# Altium schematic sheet P09 SYS of Hi3519.SchDoc
size 420 x 297 mm
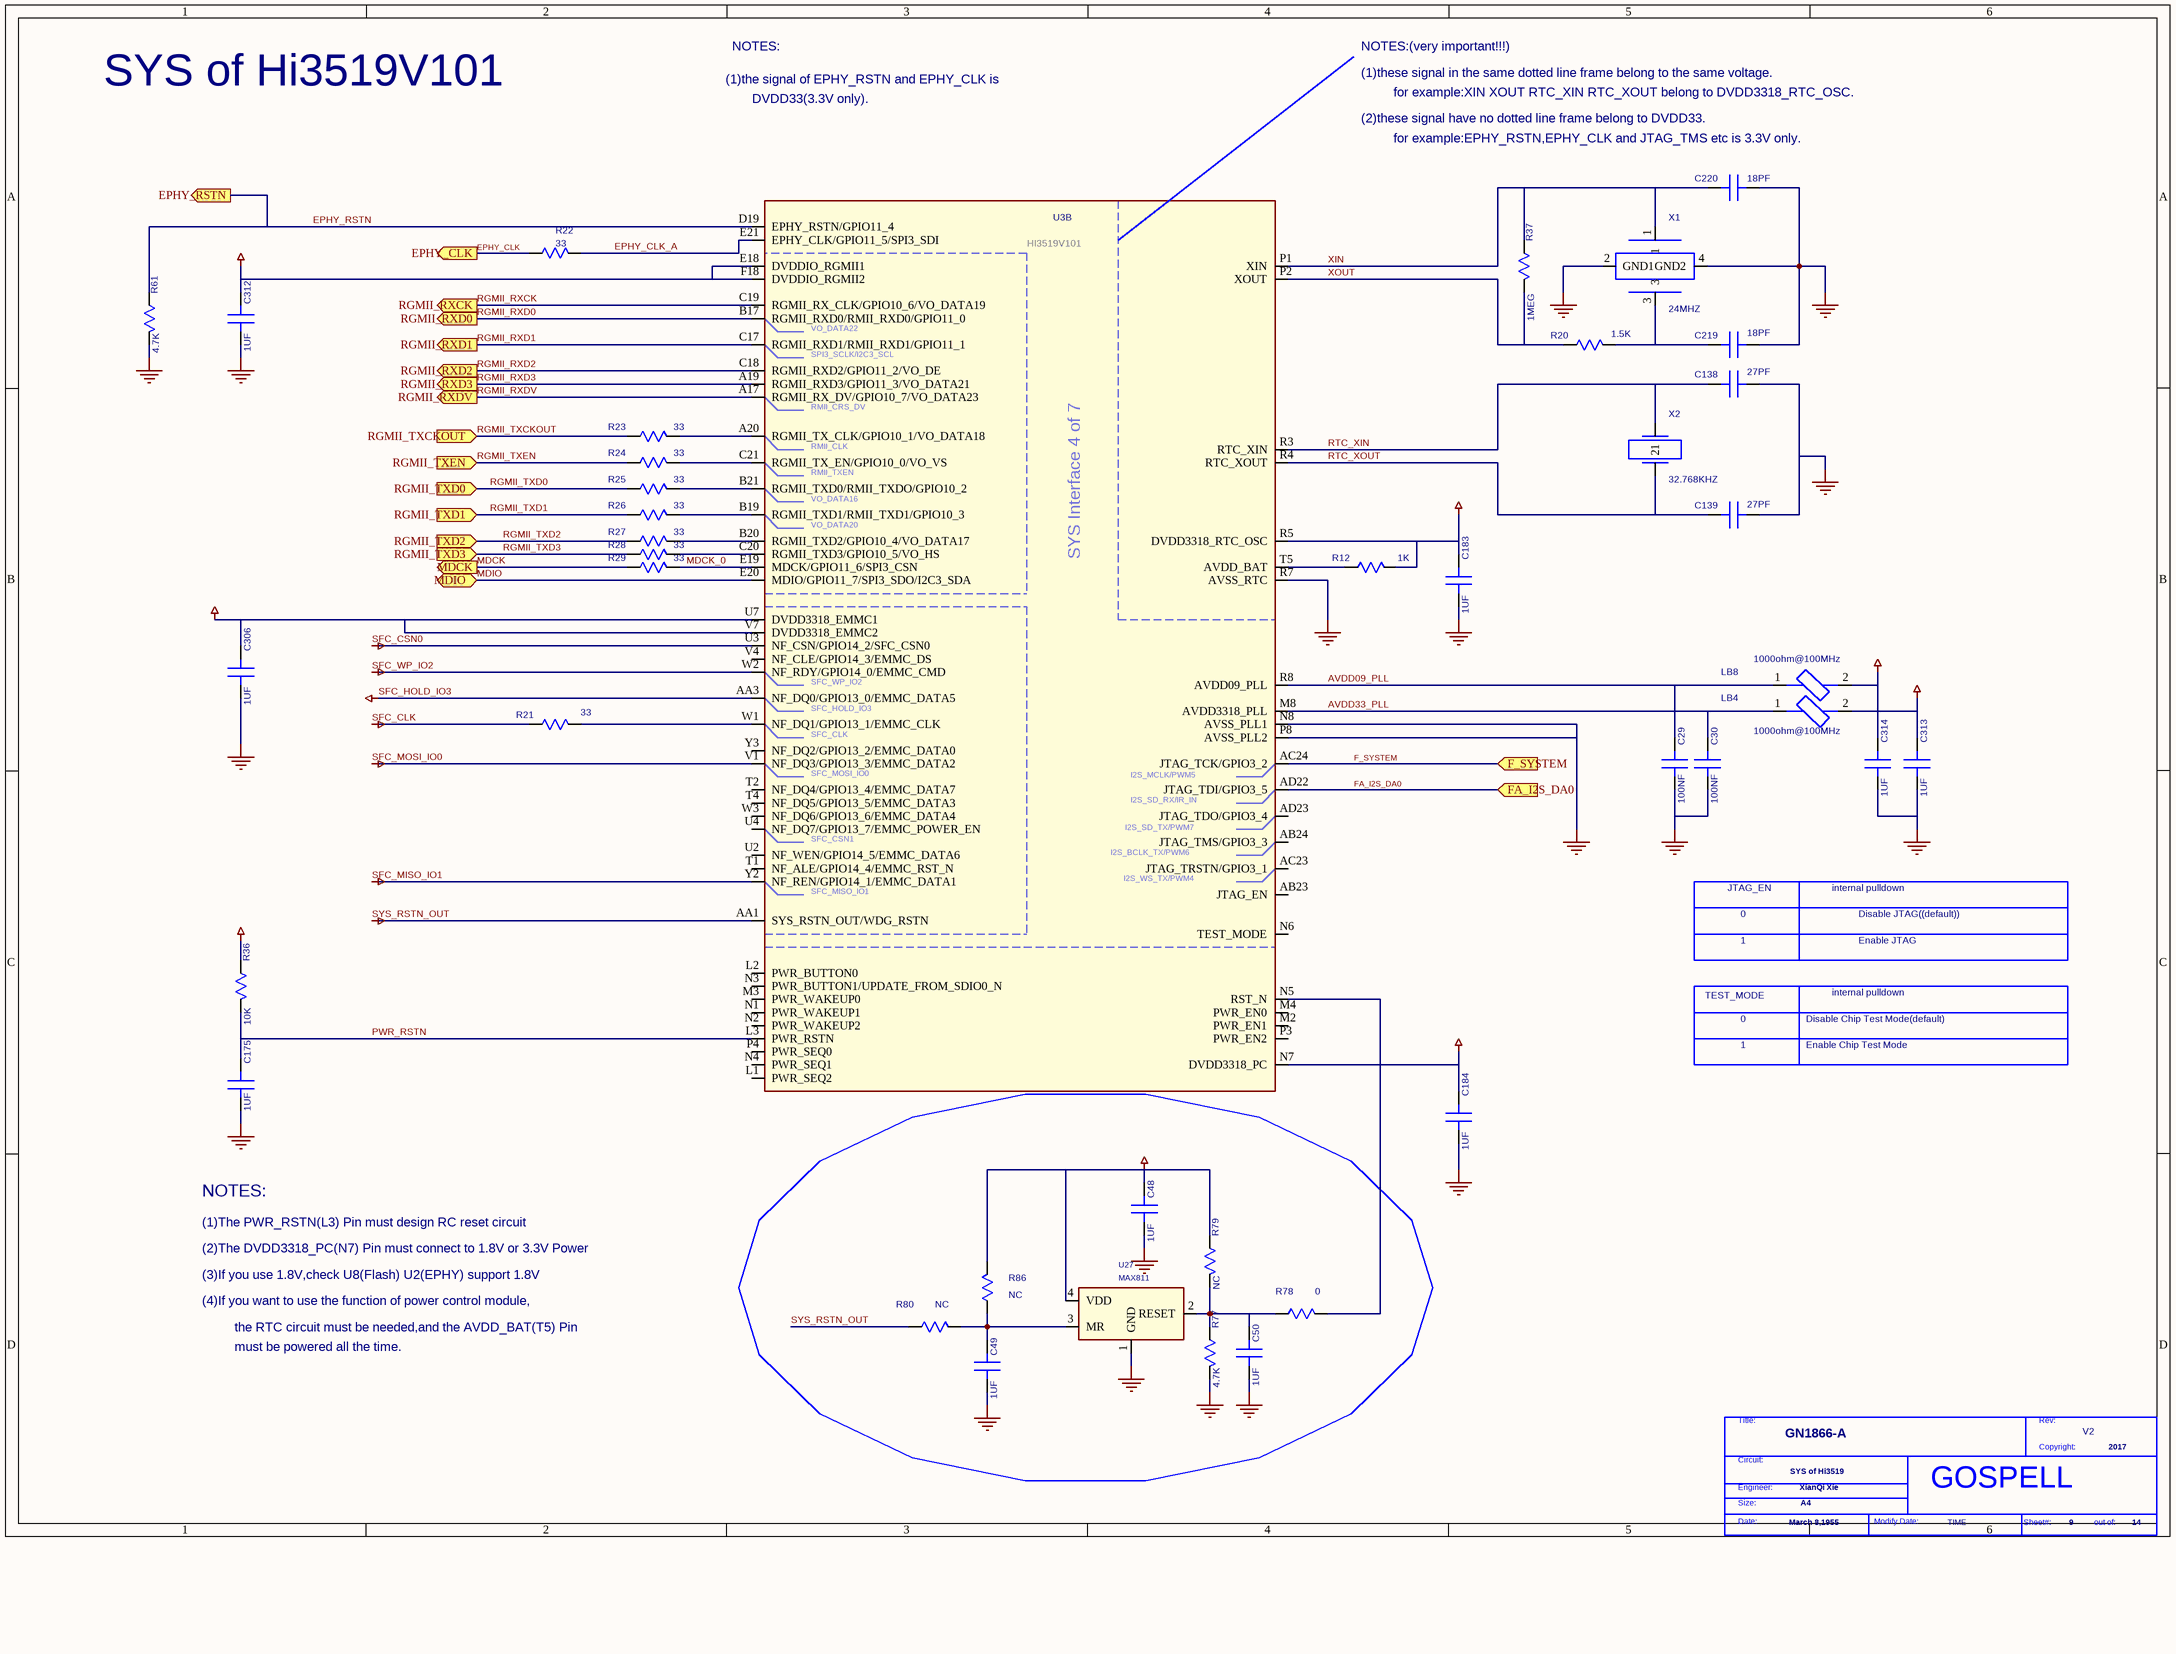
[diagram p0: P09 SYS of Hi3519.SchDoc]

## Parts
*  Page Modify Date: TIME  Engineer: XianQi Xie  Copyright: 2017  Title: GN1866-A  RevCode: V2  Page Size: A4  Page Create Date: March 8,1955  Page Number: 9  Page Count: 14  Doc: SYS of Hi3519  (hidden comment: GOSPELL)  (graphical)
C29  100NF  [HSC0201]
C30  100NF  [HSC0201]
C48  1UF  [SC0402]
C49  1UF  [SC0402]
C50  1UF  [SC0402]
C138  27PF  [SC0402]
C139  27PF  [SC0402]
C175  1UF  [HSC0201]
C183  1UF  [HSC0201]
C184  1UF  [HSC0201]
C219  18PF  [SC0402]
C220  18PF  [SC0402]
C306  1UF  [HSC0201]
C312  1UF  [HSC0201]
C313  1UF  [HSC0201]
C314  1UF  [HSC0201]
LB4  LB  [HSL0201-TB]  (value not drawn)
LB8  LB  [HSL0201-TB]  (value not drawn)
R12  1K  [SR0402]
R20  1.5K  [SR0402]
R21  33  [SR0402]
R22  33  [SR0402]
R23  33  [SR0402]
R24  33  [SR0402]
R25  33  [SR0402]
R26  33  [SR0402]
R27  33  [SR0402]
R28  33  [SR0402]
R29  33  [SR0402]
R36  10K  [SR0402]
R37  1MEG  [SR0402]
R61  4.7K  [SR0402]
R77  4.7K  [SR0402]
R78  0  [SR0402]
R79  NC  [SR0402]
R80  NC  [SR0402]
R86  NC  [SR0402]
U3  DEVICE: HI3519V101  [HBGA524-16-2424]  (hidden comment: HI3519V101_PER)  (part B of 7)
U27  MAX811  [SOT23-4]
X1  24MHZ  [HSX4-0302]
X2  32.768KHZ  [HSX2-0302]

## Ports
EPHY_CLK (out), EPHY_RSTN (out), F_SYSTEM (in), FA_I2S_DA0 (in), MDCK (out), MDIO (bidir), RGMII_RXCK (out), RGMII_RXD0 (out), RGMII_RXD1 (out), RGMII_RXD2 (out), RGMII_RXD3 (out), RGMII_RXDV (out), RGMII_TXCKOUT (in), RGMII_TXD0 (in), RGMII_TXD1 (in), RGMII_TXD2 (in), RGMII_TXD3 (in), RGMII_TXEN (in)

## Nets
3V3/1V8: C48.1(A) C183.1(A) C184.1(A) C306.1(A) C312.1(A) C313.1(A) LB4.2 R12.2(B) R36.1(A) R79.1(A) R86.2(B) U3.E18(DVDDIO_RGMII1) U3.F18(DVDDIO_RGMII2) U3.N7(DVDD3318_PC) U3.R5(DVDD3318_RTC_OSC) U3.U7(DVDD3318_EMMC1) U3.V7(DVDD3318_EMMC2) U27.4(VDD)
GND: C29.2(B) C30.2(B) C48.2(B) C49.2(B) C50.2(B) C138.2(B) C139.2(B) C175.2(B) C183.2(B) C184.2(B) C219.2(B) C220.2(B) C306.2(B) C312.2(B) C313.2(B) C314.2(B) R61.2(B) R77.2(B) U3.N8(AVSS_PLL1) U3.P8(AVSS_PLL2) U3.R7(AVSS_RTC) U27.1(GND) X1.2(GND1) X1.4(GND2)
SFC_CLK: R21.1(A)
SFC_CSN0: U3.U3(NF_CSN/GPIO14_2/SFC_CSN0)
SFC_HOLD_IO3: U3.AA3(NF_DQ0/GPIO13_0/EMMC_DATA5)
SFC_MISO_IO1: U3.Y2(NF_REN/GPIO14_1/EMMC_DATA1)
SFC_MOSI_IO0: U3.V1(NF_DQ3/GPIO13_3/EMMC_DATA2)
SFC_WP_IO2: U3.W2(NF_RDY/GPIO14_0/EMMC_CMD)
SYS_RSTN_OUT: R80.1(A) U3.AA1(SYS_RSTN_OUT/WDG_RSTN)
VCC_VDD_DDR_CORE: C314.1(A) LB8.2
AVDD09_PLL: C29.1(A) LB8.1 U3.R8(AVDD09_PLL)
AVDD33_PLL: C30.1(A) LB4.1 U3.M8(AVDD3318_PLL)
EPHY_CLK: R22.1(A) ; port EPHY_CLK
EPHY_CLK_A: R22.2(B) U3.E21(EPHY_CLK/GPIO11_5/SPI3_SDI)
EPHY_RSTN: R61.1(A) U3.D19(EPHY_RSTN/GPIO11_4) ; port EPHY_RSTN
F_SYSTEM: U3.AC24(JTAG_TCK/GPIO3_2) ; port F_SYSTEM
FA_I2S_DA0: U3.AD22(JTAG_TDI/GPIO3_5) ; port FA_I2S_DA0
MDCK: R29.1(A) ; port MDCK
MDCK_0: R29.2(B) U3.E19(MDCK/GPIO11_6/SPI3_CSN)
MDIO: U3.E20(MDIO/GPIO11_7/SPI3_SDO/I2C3_SDA) ; port MDIO
PWR_RSTN: C175.1(A) R36.2(B) U3.L3(PWR_RSTN)
RGMII_RXCK: U3.C19(RGMII_RX_CLK/GPIO10_6/VO_DATA19) ; port RGMII_RXCK
RGMII_RXD0: U3.B17(RGMII_RXD0/RMII_RXD0/GPIO11_0) ; port RGMII_RXD0
RGMII_RXD1: U3.C17(RGMII_RXD1/RMII_RXD1/GPIO11_1) ; port RGMII_RXD1
RGMII_RXD2: U3.C18(RGMII_RXD2/GPIO11_2/VO_DE) ; port RGMII_RXD2
RGMII_RXD3: U3.A19(RGMII_RXD3/GPIO11_3/VO_DATA21) ; port RGMII_RXD3
RGMII_RXDV: U3.A17(RGMII_RX_DV/GPIO10_7/VO_DATA23) ; port RGMII_RXDV
RGMII_TXCKOUT: R23.1(A) ; port RGMII_TXCKOUT
RGMII_TXD0: R25.1(A) ; port RGMII_TXD0
RGMII_TXD1: R26.1(A) ; port RGMII_TXD1
RGMII_TXD2: R27.1(A) ; port RGMII_TXD2
RGMII_TXD3: R28.1(A) ; port RGMII_TXD3
RGMII_TXEN: R24.1(A) ; port RGMII_TXEN
RTC_XIN: C138.1(A) U3.R3(RTC_XIN) X2.1
RTC_XOUT: C139.1(A) U3.R4(RTC_XOUT) X2.2
XIN: C220.1(A) R37.1(A) U3.P1(XIN) X1.1
XOUT: R20.1(A) R37.2(B) U3.P2(XOUT)
NetC49_1: C49.1(A) R80.2(B) R86.1(A) U27.3(MR)
NetC50_1: C50.1(A) R77.1(A) R78.1(A) R79.2(B) U27.2(RESET)
NetC219_1: C219.1(A) R20.2(B) X1.3
NetR12_1: R12.1(A) U3.T5(AVDD_BAT)
NetR21_2: R21.2(B) U3.W1(NF_DQ1/GPIO13_1/EMMC_CLK)
NetR23_2: R23.2(B) U3.A20(RGMII_TX_CLK/GPIO10_1/VO_DATA18)
NetR24_2: R24.2(B) U3.C21(RGMII_TX_EN/GPIO10_0/VO_VS)
NetR25_2: R25.2(B) U3.B21(RGMII_TXD0/RMII_TXDO/GPIO10_2)
NetR26_2: R26.2(B) U3.B19(RGMII_TXD1/RMII_TXD1/GPIO10_3)
NetR27_2: R27.2(B) U3.B20(RGMII_TXD2/GPIO10_4/VO_DATA17)
NetR28_2: R28.2(B) U3.C20(RGMII_TXD3/GPIO10_5/VO_HS)
NetR78_2: R78.2(B) U3.N5(RST_N)

Not connected (* = marked no-connect by the designer): U3 AB23(JTAG_EN) AB24(JTAG_TMS/GPIO3_3) AC23(JTAG_TRSTN/GPIO3_1) AD23(JTAG_TDO/GPIO3_4) L1(PWR_SEQ2) L2(PWR_BUTTON0) M2(PWR_EN1) M3(PWR_WAKEUP0) M4(PWR_EN0) N1(PWR_WAKEUP1) N2(PWR_WAKEUP2) N3(PWR_BUTTON1/UPDATE_FROM_SDIO0_N) N4(PWR_SEQ1) N6(TEST_MODE) P3(PWR_EN2) P4(PWR_SEQ0) T1(NF_ALE/GPIO14_4/EMMC_RST_N) T2(NF_DQ4/GPIO13_4/EMMC_DATA7) T4(NF_DQ5/GPIO13_5/EMMC_DATA3) U2(NF_WEN/GPIO14_5/EMMC_DATA6) U4(NF_DQ7/GPIO13_7/EMMC_POWER_EN) V4(NF_CLE/GPIO14_3/EMMC_DS) W3(NF_DQ6/GPIO13_6/EMMC_DATA4) Y3(NF_DQ2/GPIO13_2/EMMC_DATA0)

## Notes on the sheet
- NOTES:
- NOTES:(very important!!!)
- SYS of Hi3519V101
- (1)the signal of EPHY_RSTN and EPHY_CLK is
- DVDD33(3.3V only).
- (2)these signal have no dotted line frame belong to DVDD33.
- (1)these signal in the same dotted line frame belong to the same voltage.
- for example:XIN XOUT RTC_XIN RTC_XOUT belong to DVDD3318_RTC_OSC.
- (near C220) for example:EPHY_RSTN,EPHY_CLK and JTAG_TMS etc is 3.3V only.
- (near LB8) 1000ohm@100MHz
- (near LB4) 1000ohm@100MHz
- JTAG_EN
- internal pulldown
- 1
- 0
- Disable JTAG((default))
- Enable JTAG
- TEST_MODE
- Disable Chip Test Mode(default)
- Enable Chip Test Mode
- (1)The PWR_RSTN(L3) Pin must design RC reset circuit
- (3)If you use 1.8V,check U8(Flash) U2(EPHY) support 1.8V
- (2)The DVDD3318_PC(N7) Pin must connect to 1.8V or 3.3V Power
- (4)If you want to use the function of power control module,
- the RTC circuit must be needed,and the AVDD_BAT(T5) Pin
- must be powered all the time.
- (in symbol GOSPELL) Title:; Rev:; Copyright:; Circuit:; Engineer:; Size:; Date:; Modify Date:; Sheet#:; out of:
- (in symbol HI3519V101_PER_2, part B) VO_DATA22; SPI3_SCLK/I2C3_SCL; RMII_CRS_DV; RMII_CLK; RMII_TXEN; VO_DATA16; VO_DATA20; SYS Interface 4 of 7; SFC_WP_IO2; SFC_HOLD_IO3; SFC_CLK; SFC_MOSI_IO0; I2S_MCLK/PWM5; I2S_SD_RX/IR_IN; I2S_SD_TX/PWM7; SFC_CSN1; I2S_BCLK_TX/PWM6; I2S_WS_TX/PWM4; SFC_MISO_IO1

## Library data of the parts
C29 C30 = C_0_Dup2: PARTS: 1; OriginalSymbolOrigin: (0,30); DEVICE: GRM033R60J104KE19D; LEVEL: STD; PINSWAP: (A,B); CODE: 8070704; %195%%232%%202%%246%: SMD陶瓷电容-6.3V-100NF-+/-10%-X5R-0201-TS16949; %182%%238%%182%%168%%185%%164%%215%%247%%181%%231%%209%%185%(V): 6.3; COMPONENT_HIGH_MAX: 0.33MM; %208%%161%%192%%224%%195%%251%%179%%198%: SMD陶瓷电容; GVALUE: C  6.3V  0.1uF +80%~-20%  X5R 0201; PKG_TYPE: HSC0201
C48-C50 = C_0_Dup2: PARTS: 1; OriginalSymbolOrigin: (0,30); DEVICE: CV05X5R105K10AH; LEVEL: STD; PINSWAP: (A,B); GVALUE: C  10V  1uF +80%~-20%  X5R 0402; CODE: 8070612; %195%%232%%202%%246%: SMD陶瓷电容-10V-1000NF-+/-10%-X5R-0402-BT,TS16949; %182%%238%%182%%168%%185%%164%%215%%247%%181%%231%%209%%185%(V): 10; COMPONENT_HIGH_MAX: 0.55MM; %208%%161%%192%%224%%195%%251%%179%%198%: SMD陶瓷电容; PKG_TYPE: SC0402
C138 = C_0_Dup2: PARTS: 1; OriginalSymbolOrigin: (0,30); DEVICE: C0402C270J5GAC_7867; LEVEL: STD; PINSWAP: (A,B); %208%%161%%192%%224%%195%%251%%179%%198%: SMD陶瓷电容; COMPONENT_HIGH_MAX: 0.55MM; %182%%238%%182%%168%%185%%164%%215%%247%%181%%231%%209%%185%(V): 50; %195%%232%%202%%246%: SMD陶瓷电容-50V-0.027NF-+/-5%-NP0-0402-BT; CODE: 8070546; GVALUE: C  50V  27pF +80%~-20% NP0 0402; PKG_TYPE: SC0402
C139 = C_0_Dup2: PARTS: 1; OriginalSymbolOrigin: (0,30); DEVICE: C0402C270J5GAC_7867; LEVEL: STD; PINSWAP: (A,B); CODE: 8070546; %195%%232%%202%%246%: SMD陶瓷电容-50V-0.027NF-+/-5%-NP0-0402-BT; %182%%238%%182%%168%%185%%164%%215%%247%%181%%231%%209%%185%(V): 50; COMPONENT_HIGH_MAX: 0.55MM; %208%%161%%192%%224%%195%%251%%179%%198%: SMD陶瓷电容; GVALUE: C  50V  27pF +80%~-20% NP0 0402; PKG_TYPE: SC0402
C175 = C_0_Dup2: PARTS: 1; OriginalSymbolOrigin: (0,30); DEVICE: CM03X5R105M06AH_A; LEVEL: STD; PINSWAP: (A,B); %208%%161%%192%%224%%195%%251%%179%%198%: SMD陶瓷电容; COMPONENT_HIGH_MAX: 0.35MM; %195%%232%%202%%246%: SMD陶瓷电容-4V-1000NF-+/-20%-X5R-0201(0.65MM*0.35MM*0.35MM)-终端专用; CODE: 8071128; GVALUE: C  4V  1uF +80%~-20%  X5R 0201(0.65MM*0.35MM*0.35MM); PKG_TYPE: HSC0201
C183 C312 C314 = C_0_Dup2: PARTS: 1; OriginalSymbolOrigin: (0,30); DEVICE: CM03X5R105M06AH_A; LEVEL: STD; PINSWAP: (A,B); %208%%161%%192%%224%%195%%251%%179%%198%: SMD陶瓷电容; COMPONENT_HIGH_MAX: 0.35MM; %182%%238%%182%%168%%185%%164%%215%%247%%181%%231%%209%%185%(V): 6.3; %195%%232%%202%%246%: SMD陶瓷电容-4V-1000NF-+/-20%-X5R-0201(0.65MM*0.35MM*0.35MM)-终端专用; CODE: 8071128; GVALUE: C  4V  1uF +80%~-20%  X5R 0201(0.65MM*0.35MM*0.35MM); PKG_TYPE: HSC0201
C184 C313 = C_0_Dup2: PARTS: 1; OriginalSymbolOrigin: (0,30); DEVICE: CM03X5R105M06AH_A; LEVEL: STD; PINSWAP: (A,B); CODE: 8071128; %195%%232%%202%%246%: SMD陶瓷电容-4V-1000NF-+/-20%-X5R-0201(0.65MM*0.35MM*0.35MM)-终端专用; %182%%238%%182%%168%%185%%164%%215%%247%%181%%231%%209%%185%(V): 6.3; COMPONENT_HIGH_MAX: 0.35MM; %208%%161%%192%%224%%195%%251%%179%%198%: SMD陶瓷电容; GVALUE: C  4V  1uF +80%~-20%  X5R 0201(0.65MM*0.35MM*0.35MM); PKG_TYPE: HSC0201
C219 = C_0_Dup2: PARTS: 1; OriginalSymbolOrigin: (0,30); DEVICE: C0402C180J5GAC_7867; LEVEL: STD; PINSWAP: (A,B); CODE: 8070580; %195%%232%%202%%246%: SMD陶瓷电容-50V-0.018NF-+/-5%-NPO-0402; %182%%238%%182%%168%%185%%164%%215%%247%%181%%231%%209%%185%(V): 50; COMPONENT_HIGH_MAX: 0.55MM; %208%%161%%192%%224%%195%%251%%179%%198%: SMD陶瓷电容; GVALUE: C  50V  18pF +80%~-20% NPO-0402; PKG_TYPE: SC0402
C220 = C_0_Dup2: PARTS: 1; OriginalSymbolOrigin: (0,30); DEVICE: C0402C180J5GAC_7867; LEVEL: STD; PINSWAP: (A,B); GVALUE: C  50V  18pF +80%~-20% NPO-0402; CODE: 8070580; %195%%232%%202%%246%: SMD陶瓷电容-50V-0.018NF-+/-5%-NPO-0402; %182%%238%%182%%168%%185%%164%%215%%247%%181%%231%%209%%185%(V): 50; COMPONENT_HIGH_MAX: 0.55MM; %208%%161%%192%%224%%195%%251%%179%%198%: SMD陶瓷电容; PKG_TYPE: SC0402
C306 = C_0_Dup2: PARTS: 1; OriginalSymbolOrigin: (0,30); DEVICE: CM03X5R105M06AH_A; LEVEL: STD; PINSWAP: (A,B); %208%%161%%192%%224%%195%%251%%179%%198%: SMD陶瓷电容; COMPONENT_HIGH_MAX: 0.35MM; %182%%238%%182%%168%%185%%164%%215%%247%%181%%231%%209%%185%(V): 10; %195%%232%%202%%246%: SMD陶瓷电容-4V-1000NF-+/-20%-X5R-0201(0.65MM*0.35MM*0.35MM)-终端专用; CODE: 8071128; GVALUE: C  4V  1uF +80%~-20%  X5R 0201(0.65MM*0.35MM*0.35MM); PKG_TYPE: HSC0201
LB4 = LB_0: PARTS: 1; OriginalSymbolOrigin: (20,50); LEVEL: STD; DEVICE: NOOO; CODE: 99053XWH; %195%%232%%202%%246%: EMI磁珠-+/-25%-1000OHM-1.25OHM-0.25A-0402-1400OHM@1GHZ; COMPONENT_HIGH_MAX: 0.65MM; %208%%161%%192%%224%%195%%251%%179%%198%: EMI磁珠; GVALUE: 麦捷:0201磁珠80欧; PKG_TYPE: HSL0201-TB
LB8 = LB_0: PARTS: 1; OriginalSymbolOrigin: (20,50); LEVEL: STD; DEVICE: NOOO; CODE: 99053XWH; %208%%161%%192%%224%%195%%251%%179%%198%: EMI磁珠; COMPONENT_HIGH_MAX: 0.65MM; %195%%232%%202%%246%: EMI磁珠-+/-25%-1000OHM-1.25OHM-0.25A-0402-1400OHM@1GHZ; GVALUE: 麦捷:0201磁珠80欧; PKG_TYPE: HSL0201-TB
R12 = R_0: PARTS: 1; OriginalSymbolOrigin: (10,20); PINSWAP: (A,B); DEVICE: RC0603JR_07510R; PKG_TYPE: SR0603; LEVEL: STD; CODE: 7090638; %195%%232%%202%%246%: 片式厚膜电阻器-0.1W-510OHM-+/-5%-0603; %182%%238%%182%%168%%185%%166%%194%%202%(W): 0.1; %215%%232%%214%%181%%212%%202%%208%%237%%198%%171%%178%%238%: +/-5%; COMPONENT_HIGH_MAX: 0.55MM; %208%%161%%192%%224%%195%%251%%179%%198%: 片式厚膜电阻器; GVALUE: R 1/16W 1K±5% 0402
R20 = R_0: PARTS: 1; OriginalSymbolOrigin: (10,20); PINSWAP: (A,B); DEVICE: RC_02W100FT; LEVEL: STD; CODE: 7091305; %195%%232%%202%%246%: 片式厚膜电阻器-0.0625W-10OHM-+/-1%-0402; %182%%238%%182%%168%%185%%166%%194%%202%(W): 0.06; %215%%232%%214%%181%%212%%202%%208%%237%%198%%171%%178%%238%: +/-1%; COMPONENT_HIGH_MAX: 0.4MM; %208%%161%%192%%224%%195%%251%%179%%198%: 片式厚膜电阻器; GVALUE: R 1/16W 1.5K±5% 0402; PKG_TYPE: SR0402
R21 R23-R29 = R_0: PARTS: 1; OriginalSymbolOrigin: (10,20); PINSWAP: (A,B); DEVICE: RC0402FR_0733RL; LEVEL: STD; CODE: 7090836; %195%%232%%202%%246%: 片式厚膜电阻器-0.0625W-33OHM-+/-1%-0402; %182%%238%%182%%168%%185%%166%%194%%202%(W): 0.06; %215%%232%%214%%181%%212%%202%%208%%237%%198%%171%%178%%238%: +/-1%; COMPONENT_HIGH_MAX: 0.4MM; %208%%161%%192%%224%%195%%251%%179%%198%: 片式厚膜电阻器; GVALUE: R 1/16W 33±5% 0402; PKG_TYPE: SR0402
R22 = R_0: PARTS: 1; OriginalSymbolOrigin: (10,20); PINSWAP: (A,B); DEVICE: RC0402FR_0733RL; LEVEL: STD; %208%%161%%192%%224%%195%%251%%179%%198%: 片式厚膜电阻器; COMPONENT_HIGH_MAX: 0.4MM; %215%%232%%214%%181%%212%%202%%208%%237%%198%%171%%178%%238%: +/-1%; %182%%238%%182%%168%%185%%166%%194%%202%(W): 0.06; %195%%232%%202%%246%: 片式厚膜电阻器-0.0625W-33OHM-+/-1%-0402; CODE: 7090836; GVALUE: R 1/16W 33±5% 0402; PKG_TYPE: SR0402
R36 = R_0: PARTS: 1; OriginalSymbolOrigin: (10,20); PINSWAP: (A,B); DEVICE: RC_02W103JT; LEVEL: STD; CODE: 7090815; %195%%232%%202%%246%: 片式厚膜电阻器-0.0625W-10000OHM-+/-5%-0402-BT; %182%%238%%182%%168%%185%%166%%194%%202%(W): 0.06; %215%%232%%214%%181%%212%%202%%208%%237%%198%%171%%178%%238%: +/-5%; COMPONENT_HIGH_MAX: 0.4MM; %208%%161%%192%%224%%195%%251%%179%%198%: 片式厚膜电阻器; GVALUE: R 1/16W 10K±5% 0402; PKG_TYPE: SR0402
R37 = R_0: PARTS: 1; OriginalSymbolOrigin: (10,20); PINSWAP: (A,B); DEVICE: RK73H1ETTP1004F; LEVEL: STD; GVALUE: R 1/16W 1M±5% 0402; CODE: 7090857; %195%%232%%202%%246%: 片式厚膜电阻器-0.0625W-1000000OHM-+/-1%-0402; %182%%238%%182%%168%%185%%166%%194%%202%(W): 0.06; %215%%232%%214%%181%%212%%202%%208%%237%%198%%171%%178%%238%: +/-1%; COMPONENT_HIGH_MAX: 0.4MM; %208%%161%%192%%224%%195%%251%%179%%198%: 片式厚膜电阻器; PKG_TYPE: SR0402
R61 = R_0: PARTS: 1; OriginalSymbolOrigin: (10,20); PINSWAP: (A,B); DEVICE: RK73B1ELTP472J; LEVEL: STD; CODE: 7090793; %195%%232%%202%%246%: 片式厚膜电阻器-0.0625W-4700OHM-+/-5%-0402-BT; %182%%238%%182%%168%%185%%166%%194%%202%(W): 0.06; %215%%232%%214%%181%%212%%202%%208%%237%%198%%171%%178%%238%: +/-5%; COMPONENT_HIGH_MAX: 0.4MM; %208%%161%%192%%224%%195%%251%%179%%198%: 片式厚膜电阻器; GVALUE: R 1/16W 4.7K±5% 0402; PKG_TYPE: SR0402
R77 = R_0: PARTS: 1; OriginalSymbolOrigin: (10,20); PINSWAP: (A,B); DEVICE: RK73B1ELTP472J; LEVEL: STD; %208%%161%%192%%224%%195%%251%%179%%198%: 片式厚膜电阻器; COMPONENT_HIGH_MAX: 0.4MM; %215%%232%%214%%181%%212%%202%%208%%237%%198%%171%%178%%238%: +/-5%; %182%%238%%182%%168%%185%%166%%194%%202%(W): 0.06; %195%%232%%202%%246%: 片式厚膜电阻器-0.0625W-4700OHM-+/-5%-0402-BT; CODE: 7090793; GVALUE: R 1/16W 4.7K±5% 0402; PKG_TYPE: SR0402
R78 = R_0: PARTS: 1; OriginalSymbolOrigin: (10,20); PINSWAP: (A,B); DEVICE: RK73B1ELTP472J; LEVEL: STD; %208%%161%%192%%224%%195%%251%%179%%198%: 片式厚膜电阻器; COMPONENT_HIGH_MAX: 0.4MM; %215%%232%%214%%181%%212%%202%%208%%237%%198%%171%%178%%238%: +/-5%; %182%%238%%182%%168%%185%%166%%194%%202%(W): 0.06; %195%%232%%202%%246%: 片式厚膜电阻器-0.0625W-4700OHM-+/-5%-0402-BT; CODE: 7090793; GVALUE: R 1/16W 0±5% 0402; PKG_TYPE: SR0402
R79 R80 = R_0: PARTS: 1; OriginalSymbolOrigin: (10,20); PINSWAP: (A,B); DEVICE: RK73B1ELTP472J; LEVEL: STD; CODE: 7090793; %195%%232%%202%%246%: 片式厚膜电阻器-0.0625W-4700OHM-+/-5%-0402-BT; %182%%238%%182%%168%%185%%166%%194%%202%(W): 0.06; %215%%232%%214%%181%%212%%202%%208%%237%%198%%171%%178%%238%: +/-5%; COMPONENT_HIGH_MAX: 0.4MM; %208%%161%%192%%224%%195%%251%%179%%198%: 片式厚膜电阻器; PKG_TYPE: SR0402; GVALUE: NC
R86 = R_0: PARTS: 1; OriginalSymbolOrigin: (10,20); PINSWAP: (A,B); DEVICE: RK73B1ELTP472J; LEVEL: STD; %208%%161%%192%%224%%195%%251%%179%%198%: 片式厚膜电阻器; COMPONENT_HIGH_MAX: 0.4MM; %215%%232%%214%%181%%212%%202%%208%%237%%198%%171%%178%%238%: +/-5%; %182%%238%%182%%168%%185%%166%%194%%202%(W): 0.06; %195%%232%%202%%246%: 片式厚膜电阻器-0.0625W-4700OHM-+/-5%-0402-BT; CODE: 7090793; PKG_TYPE: SR0402; GVALUE: NC
U3 = HI3519V101_PER_2: PARTS: 1; OriginalSymbolOrigin: (0,840); LEVEL: STD; HETERO: (HI3519V101_PWR),(HI3519V101_DDR),(HI3519V101_SYS),(HI3519V101_VIVO),(HI3519V101_PER),(HI3519V101_VSS1),(HI3519V101_VSS2); CODE: G01428016_MODZH; %195%%232%%202%%246%: 请注意是HDI板，建库的时候请注意下-02323838; COMPONENT_HIGH_MAX: 0.98MM; CaptureCellPackProp: HI3519V101_PERB; FORWARD_PCB: 1; PKG_TYPE: HBGA524-16-2424; GVALUE: HI3519V101_PER
X1 = X_B_0: PARTS: 1; OriginalSymbolOrigin: (20,80); LEVEL: STD; DEVICE: NX3225SA24MHZ; CODE: 12020151; %195%%232%%202%%246%: 晶体谐振器-24MHZ-12PF-±30PPM-50OHM-HCX-3SB-终端专用-终端专用; COMPONENT_HIGH_MAX: 0.75MM; %208%%161%%192%%224%%195%%251%%179%%198%: 晶体谐振器; GVALUE: 无源晶体 NX3225SA-24MHZ 30PPM 20PF; PKG_TYPE: HSX4-0302
X2 = X_0: PARTS: 1; OriginalSymbolOrigin: (10,40); LEVEL: STD; DEVICE: 9H03200019; CODE: 12020212; %195%%232%%202%%246%: 晶体谐振器-0.032768MHZ-12.5PF-+/-20PPM-70000OHM-SMD3.2*1.5; COMPONENT_HIGH_MAX: 0.85MM; %208%%161%%192%%224%%195%%251%%179%%198%: 晶体谐振器; GVALUE: 无源晶体 NX3225SA-24MHZ 30PPM 20PF; PKG_TYPE: HSX2-0302
* = GOSPELL: Cage Code: 2017
U27 = MAX811: GVALUE: MAX811